# EasyEDA Pro project ArmRobot.eprj

# Schematic ArmRobot
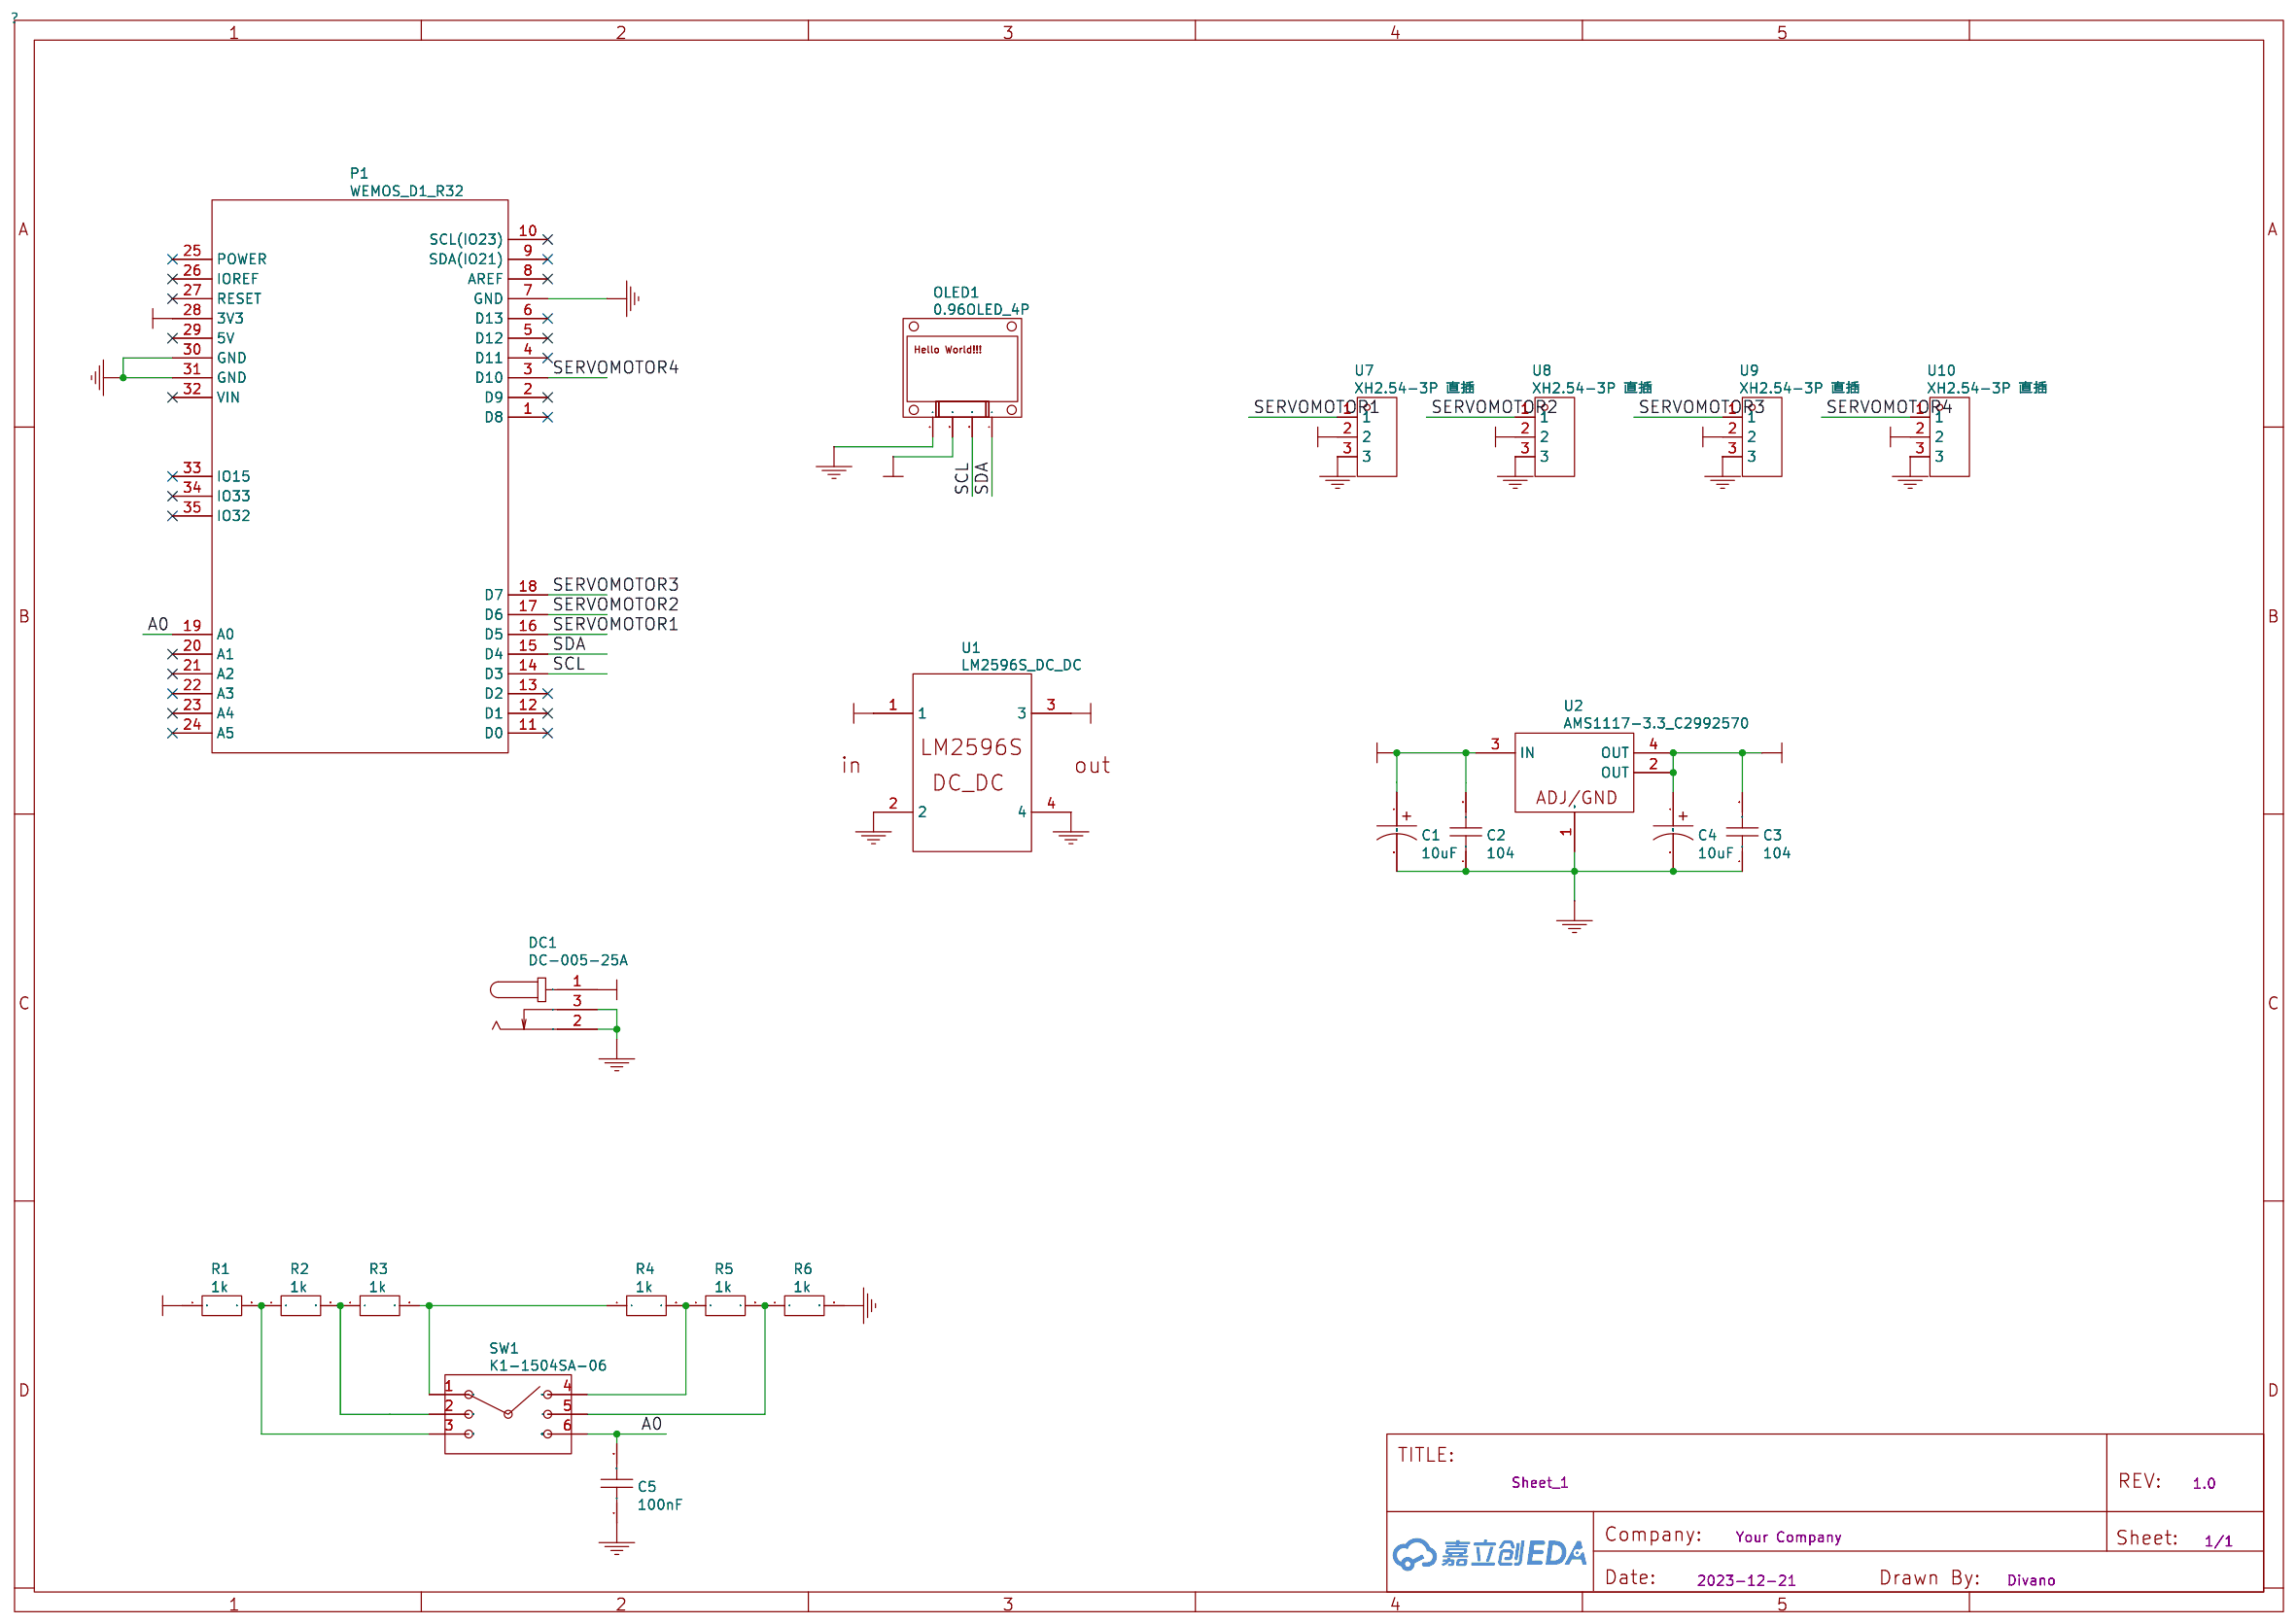
[diagram p0: schematic sheet]

## Parts
C1  10uF  [CASE-A_3216]
C2  104  [C0805]
C3  104  [C0805]
C4  10uF  [CASE-A_3216]
C5  100nF  [C0805]
DC1  DC-005-25A  [DC-IN-TH_DC005]
OLED1  0.96OLED_4P  [0.96OLED_4P]
P1  WEMOS_D1_R32  [WEMOS_D1_R32]
R1  1k  [R0805]
R2  1k  [R0805]
R3  1k  [R0805]
R4  1k  [R0805]
R5  1k  [R0805]
R6  1k  [R0805]
SW1  K1-1504SA-06  [SW-SMD_K1-1504SA-06]
U1  LM2596S_DC_DC  [LM2596S_DC_DC]
U2  AMS1117-3.3_C2992570  [SOT-223-3_L6.4-W3.5-P2.30-LS7.0-BR]
U7  XH2.54-3P 直插  [CONN-TH_XH2.54-3P]
U8  XH2.54-3P 直插  [CONN-TH_XH2.54-3P]
U9  XH2.54-3P 直插  [CONN-TH_XH2.54-3P]
U10  XH2.54-3P 直插  [CONN-TH_XH2.54-3P]

## Library data of the parts
C1 C4 = 10uF
C2 C3 = 104
C5 = 100nF
DC1 = DC-005-25A: Supplier: LCSC; Manufacturer: HRO; Supplier Part: C136715; JLCPCB Part Class: Extended Part; link: https://so.szlcsc.com/global.html?k=C136715&amp;ref=editor
OLED1 = 0.96OLED_4P: Supplier: LCSC
P1 = WEMOS_D1_R32: Manufacturer Part: NA; Supplier Part: TAOBAO; Manufacturer: NA; link: NA
R1-R6 = 1k
SW1 = K1-1504SA-06: Supplier: LCSC; Manufacturer: 韩国韩荣; Supplier Part: C136712; JLCPCB Part Class: Extended Part; link: https://so.szlcsc.com/global.html?k=C136712&amp;ref=editor
U1 = LM2596S_DC_DC
U2 = AMS1117-3.3_C2992570: Supplier: LCSC; Supplier Part: C2992570; Manufacturer: 国芯佳品; Manufacturer Part: AMS1117-3.3; JLCPCB Part Class: Extended Part; link: https://so.szlcsc.com/global.html?k=C2992570&amp;ref=editor
U7-U10 = XH2.54-3P 直插: Supplier: LCSC; Supplier Part: C9900000727; Manufacturer: null; JLCPCB Part Class: Extended Part; link: https://so.szlcsc.com/global.html?k=C9900000727&amp;ref=editor

## Nets
+3.3V: C3.2 C4.1 OLED1.2 P1.28(3V3) R1.1 U2.2(OUT) U2.4(OUT)
+5V: C1.1 C2.2 U1.3 U2.3(IN) U7.2 U8.2 U9.2 U10.2
+12V: DC1.1 U1.1
GND: C1.2 C2.1 C3.1 C4.2 C5.1 DC1.2 DC1.3 OLED1.1 P1.7(GND) P1.30(GND) P1.31(GND) R6.2 U1.2 U1.4 U2.1(ADJ/GND) U7.3 U8.3 U9.3 U10.3
A0: C5.2 P1.19(A0) SW1.6(COMMON)
SCL: OLED1.3 P1.14(D3)
SDA: OLED1.4 P1.15(D4)
SERVOMOTOR1: P1.16(D5) U7.1
SERVOMOTOR2: P1.17(D6) U8.1
SERVOMOTOR3: P1.18(D7) U9.1
SERVOMOTOR4: P1.3(D10) U10.1
SW1_1: R3.2 R4.1 SW1.1(A)
SW1_2: R2.2 R3.1 SW1.2(B)
SW1_3: R1.2 R2.1 SW1.3(C)
SW1_4: R4.2 R5.1 SW1.4(CENTER)
SW1_5: R5.2 R6.1 SW1.5(D)

Not connected (* = marked no-connect by the designer): P1 1(D8)* 2(D9)* 4(D11)* 5(D12)* 6(D13)* 8(AREF)* 9(SDA(IO21))* 10(SCL(IO23))* 11(D0)* 12(D1)* 13(D2)* 20(A1)* 21(A2)* 22(A3)* 23(A4)* 24(A5)* 25(POWER)* 26(IOREF)* 27(RESET)* 29(5V)* 32(VIN)* 33(IO15)* 34(IO33)* 35(IO32)*

# Board PCB_ArmRobot
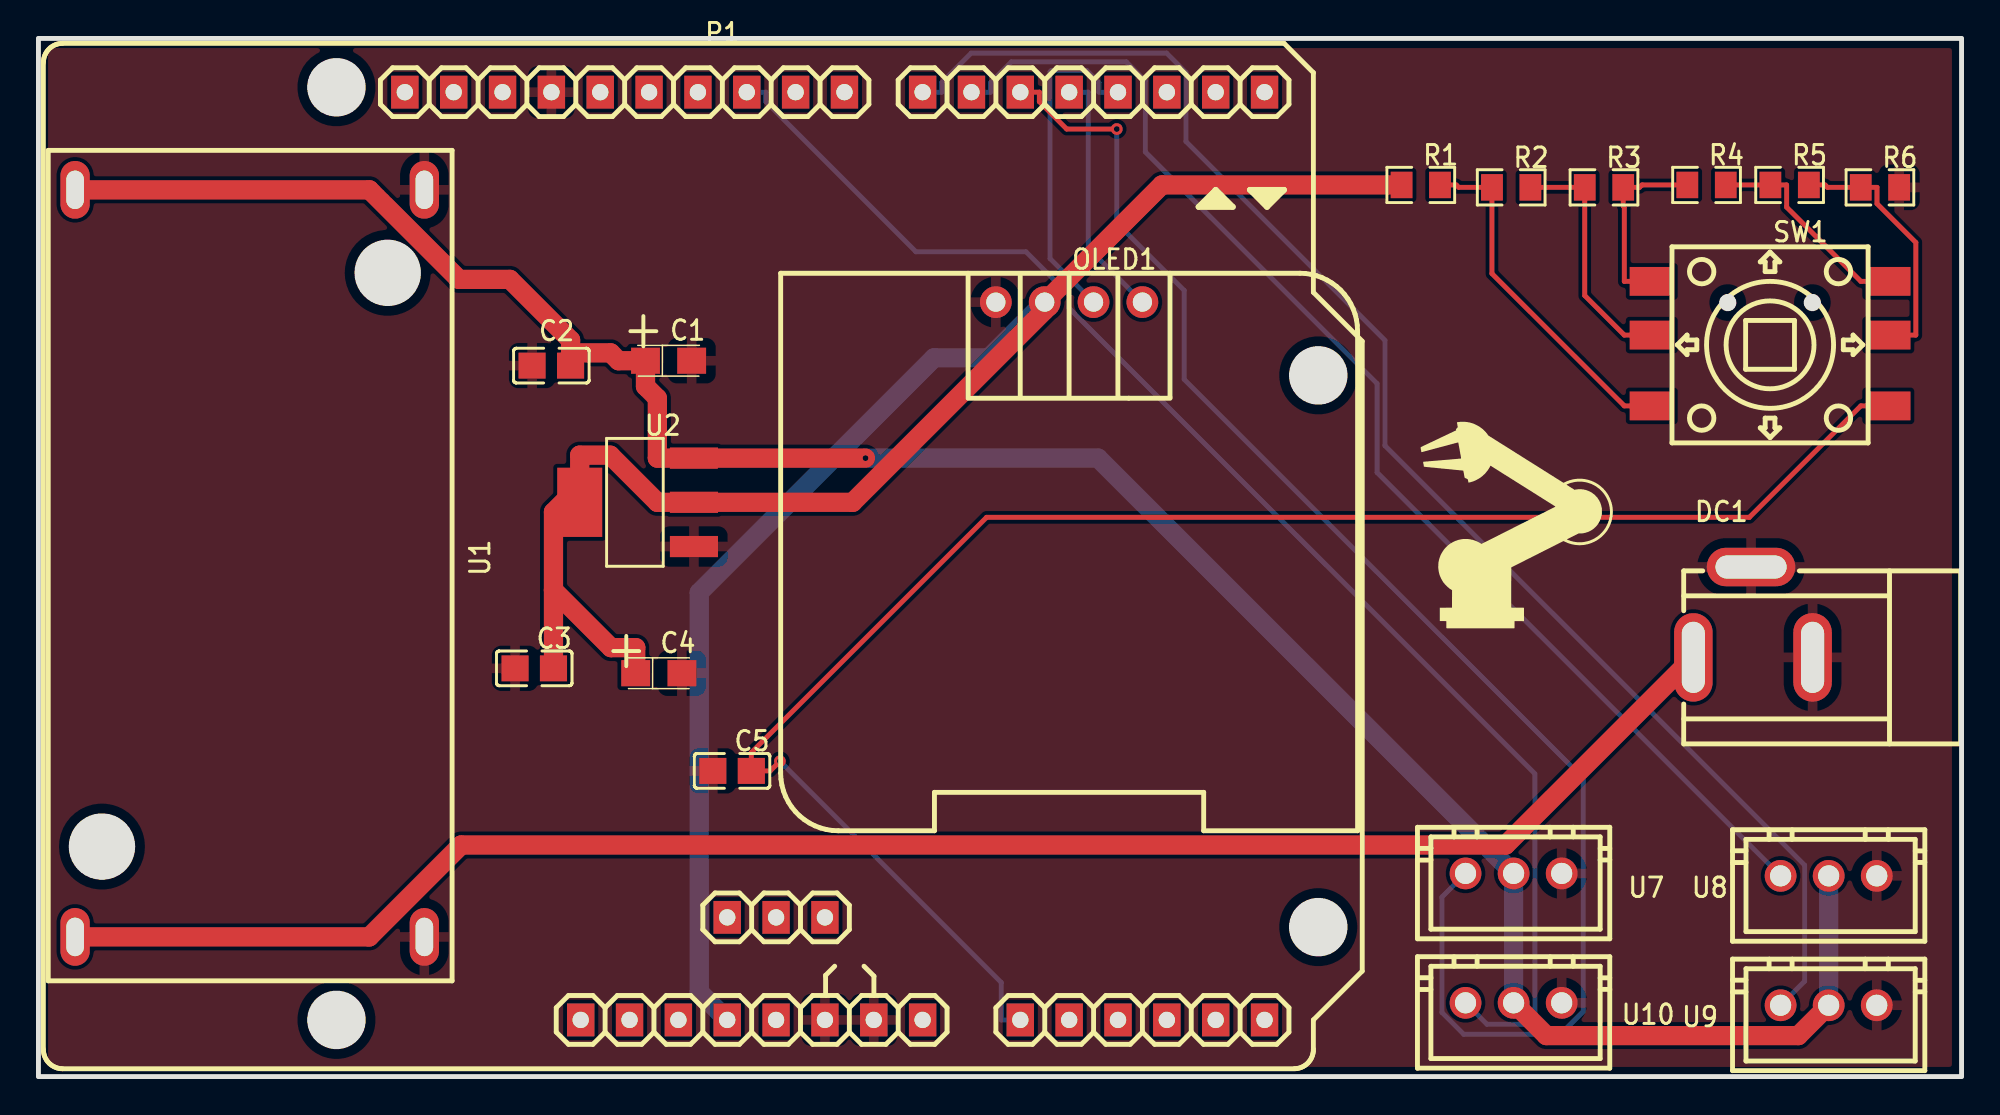
[diagram p1: board, top side]
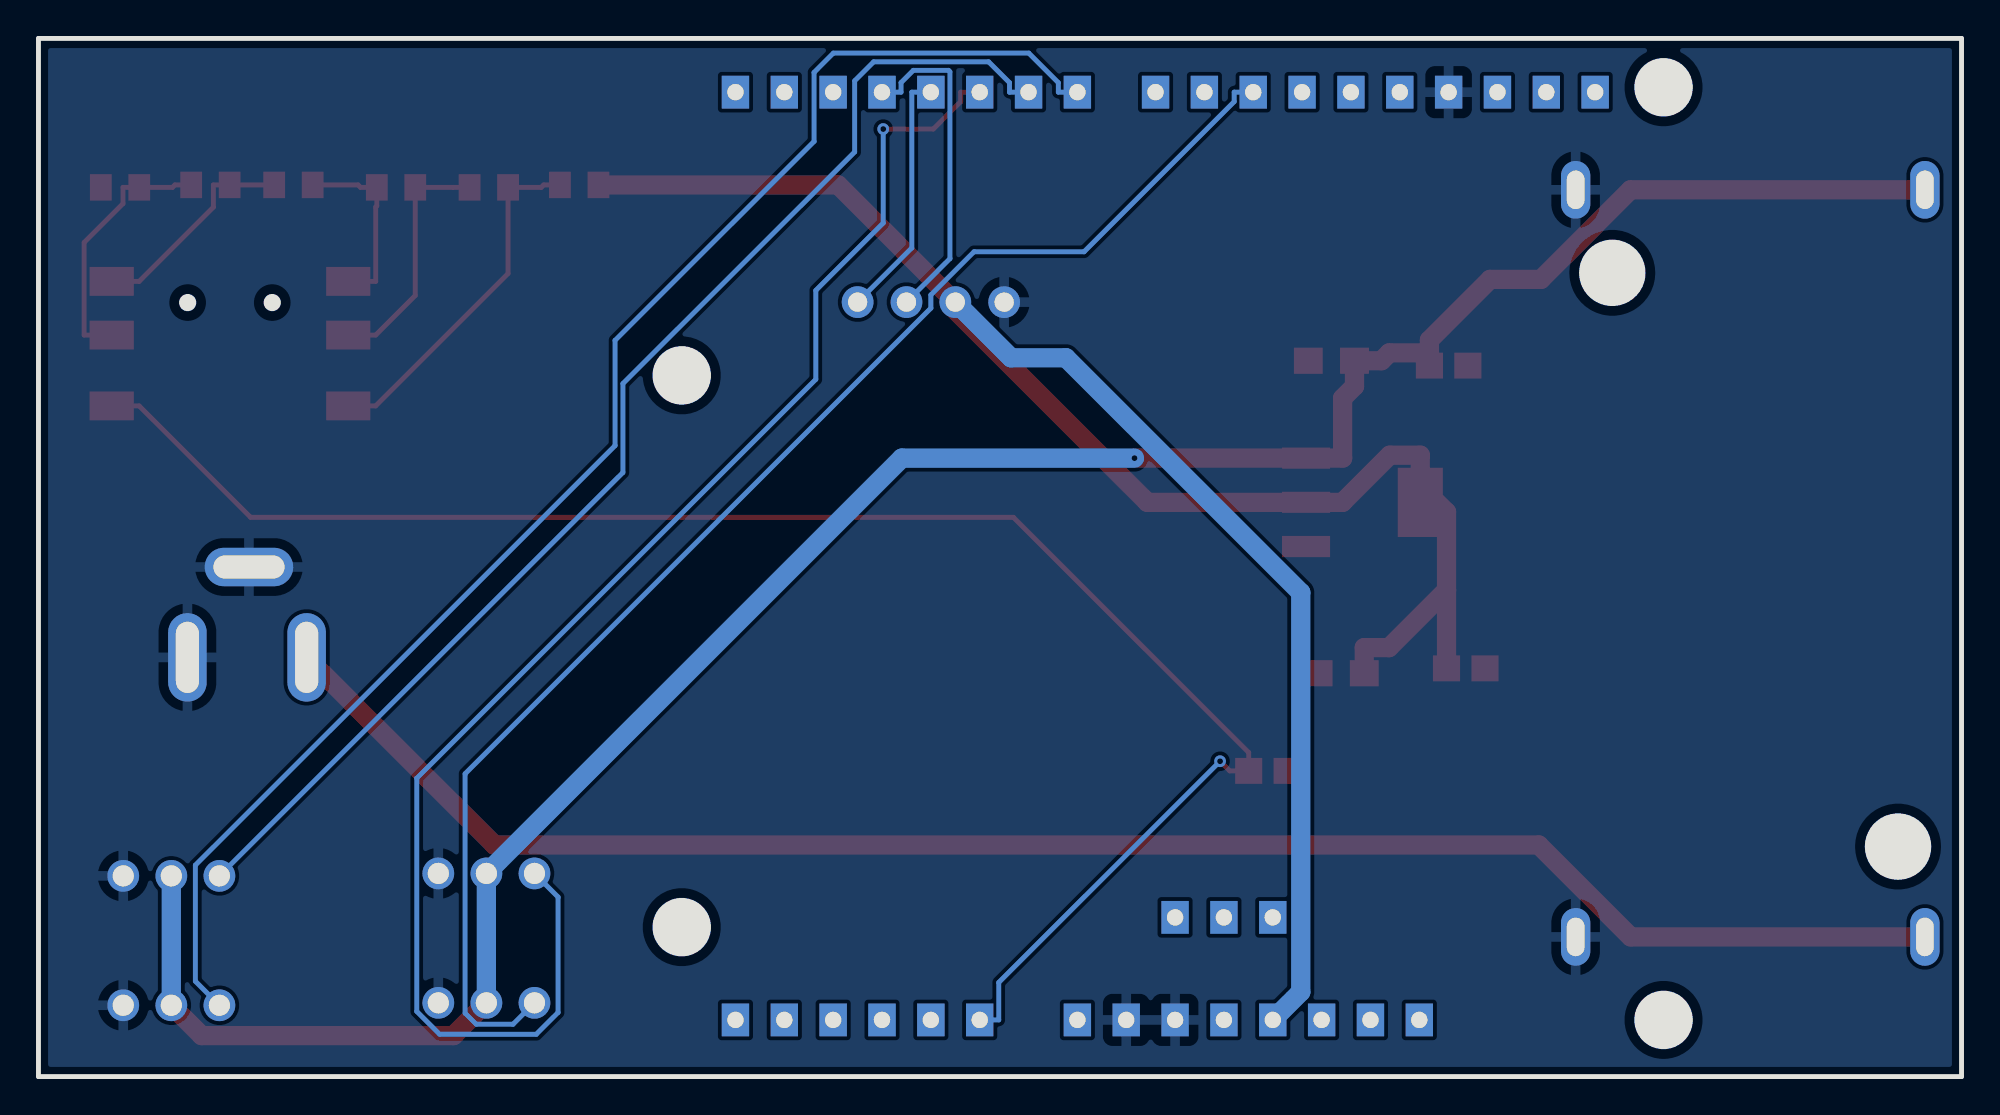
[diagram p2: board, bottom side, seen from below]

Outline 100 x 54 mm; copper layers: Top Layer, Bottom Layer. Coordinates in mm from the lower left corner of the outline.
Outline path: 0,54 100,54 100,0 0,0 0,54
Stack: Top Layer 0.035mm / Dielectric1 1.51mm FR4 er 4.5 / Bottom Layer 0.035mm

## Design rules (mm)
spacing Default (default): track to track 0.152, other pairs 0 to 0.152
spacing Power: track to track 0.152, other pairs 0 to 0.152
track width Default (default): min 0.254, default 0.254, max 25.4
track width Power: min 1, default 1, max 25.4
differential pair differentialPair (default): width min 0.127, default 0.254, max 2.54; gap min 0.152, default 0.152
via Default (default): diameter min 0.61, default 0.61, max 100.025; hole min 0.305, default 0.305, max 59.995
via Power: diameter min 0.61, default 0.61, max 100.025; hole min 0.305, default 0.305, max 59.995
net +3.3V uses Power
net +5V uses Power
net +12V uses Power
net GND uses gge8155
pour e64 uses gge8161
pour e150 uses gge8155

## Placement (name value [footprint] x y rotation side)
C1  10uF  [CASE-A_3216]  32.77 37.24 0 top
C2  104  [C0805]  26.67 36.98 0 top
C3  104  [C0805]  25.78 21.23 0 top
C4  10uF  [CASE-A_3216]  32.26 20.98 0 top
C5  100nF  [C0805]  36.07 15.9 0 top
DC1  DC-005-25A  [DC-IN-TH_DC005]  89.15 24.16 180 top
OLED1  -  [0.96OLED_4P]  53.59 40.28 0 top
P1  -  [WEMOS_D1_R32]  34.54 27.08 0 top
R1  1k  [R0805]  71.88 46.38 0 top
R2  1k  [R0805]  76.58 46.25 0 top
R3  1k  [R0805]  81.41 46.25 0 top
R4  1k  [R0805]  86.74 46.38 0 top
R5  1k  [R0805]  91.06 46.38 0 top
R6  1k  [R0805]  95.76 46.25 0 top
SW1  K1-1504SA-06  [SW-SMD_K1-1504SA-06]  90.04 38.12 0 top
U1  -  [LM2596S_DC_DC]  0.51 4.98 90 top
U2  AMS1117-3.3_C2992570  [SOT-223-3_L6.4-W3.5-P2.30-LS7.0-BR]  31.12 29.87 0 top
U7  XH2.54-3P 直插  [CONN-TH_XH2.54-3P]  76.71 10.57 0 top
U8  XH2.54-3P 直插  [CONN-TH_XH2.54-3P]  93.09 10.44 0 top
U9  XH2.54-3P 直插  [CONN-TH_XH2.54-3P]  93.09 3.71 0 top
U10  XH2.54-3P 直插  [CONN-TH_XH2.54-3P]  76.71 3.84 0 top

## Footprints (pads in the part's own frame, mm; a bottom-side part is the same pattern mirrored in y, then rotated)
0.96OLED_4P
  round 1.65 hole 1: 1(-3.81,-0.002) 2(-1.27,0.002) 3(1.27,0.002) 4(3.81,0.002)
C0805
  rect 1.41x1.35 smd: 1(-1,0) 2(1,0)
CASE-A_3216
  rect 1.5x1.359 smd: 1(-1.2,0) 2(1.2,0)
CONN-TH_XH2.54-3P
  round 1.65 hole 1.1: 1(-2.5,0) 2(0,0) 3(2.5,0)
DC-IN-TH_DC005
  oval 2x4.6 hole 1.2x3.7: 1(3.1,2.35) 2(-3.1,2.35)
  oval 4.6x2 hole 3.7x1.2: 3(0.1,-2.35)
LM2596S_DC_DC
  oval 3x1.524 hole 2x0.914: 1(2.286,-1.397) 2(2.286,-19.558) 3(41.148,-1.397) 4(41.148,-19.558)
R0805
  rect 1.133x1.377 smd: 1(-1,0) 2(1,0)
SOT-223-3_L6.4-W3.5-P2.30-LS7.0-BR
  rect 2.5x1.1 smd: 1(2.97,-2.3) 2(2.97,0) 3(2.97,2.3)
  rect 2.34x3.6 smd: 4(-2.97,0)
SW-SMD_K1-1504SA-06
  rect 2.3x1.5 smd: 1(-6.15,3.239) 2(-6.15,0.445) 3(-6.15,-3.239) 4(6.15,3.239) 5(6.15,0.445) 6(6.15,-3.239)
WEMOS_D1_R32
  rect 1.423x1.707 hole 0.849: 1(7.368,24.13) 2(4.828,24.13) 3(2.288,24.13) 4(-0.252,24.13) 5(-2.792,24.13) 6(-5.332,24.13) 7(-7.872,24.13) 8(-10.412,24.13) 9(-12.952,24.13) 10(-15.492,24.13) 11(29.212,24.13) 12(26.672,24.13) 13(24.132,24.13) 14(21.592,24.13) 15(19.052,24.13) 16(16.512,24.13) 17(13.972,24.13) 18(11.432,24.13) 19(16.512,-24.13) 20(19.052,-24.13) 21(21.592,-24.13) 22(24.132,-24.13) 23(26.672,-24.13) 24(29.212,-24.13) 25(-6.348,-24.13) 26(-3.808,-24.13) 27(-1.268,-24.13) 28(1.272,-24.13) 29(3.812,-24.13) 30(6.352,-24.13) 31(8.892,-24.13) 32(11.432,-24.13) 33(1.272,-18.796) 34(3.812,-18.796) 35(6.352,-18.796)

## Nets
As in the schematic.

Pads without a net: P1 1 2 4 5 6 8 9 10 11 12 13 20 21 22 23 24 25 26 27 29 32 33 34 35

## Via types
v1: diameter 0.61, hole 0.305, Top Layer to Bottom Layer, 3 vias

## Routing (per net, layer and track width the routed paths; a pad name or vN(x,y) marks a point on that pad's centre or on a via; arc(x,y) is an arc through that point)
+3.3V: length 117.3
  Top Layer w1: 26.78,25.3 C3.2 ; 26.78,25.3 29.77,22.31 31.06,22.31 C4.1 ; 26.78,25.3 26.78,29.37 28.15,30.73 ; R1.1 58.42,46.38 OLED1.2 52.32,39.86 42.34,29.87 U2.2 32.18,29.87 29.73,32.32 28.15,32.32 28.15,30.73 ; 28.15,30.73 U2.4
  Bottom Layer w1: P1.28 34.36,4.4 34.36,25.18 46.57,37.39 49.43,37.39 OLED1.2
+5V: length 124.4
  Top Layer w1: U1.3 17.21,46.13 21.87,41.47 24.51,41.47 27.67,38.31 27.67,37.65 ; U9.2 91.51,2.13 78.41,2.13 U10.2 ; 27.67,37.65 C2.2 ; 27.67,37.65 29.75,37.65 30.16,37.24 C1.1 31.57,35.9 32.18,35.29 32.18,32.17 U2.3 v1(43.01,32.17)
  Bottom Layer w1: U9.2 U8.2 ; U10.2 U7.2 55.1,32.17 v1(43.01,32.17)
+12V: length 90.2
  Top Layer w1: DC1.1 76.29,12.05 21.98,12.05 17.2,7.26 U1.1
A0: length 88.5
  Top Layer w0.254: v1(38.56,16.4) 38.05,15.9 C5.2 37.07,16.85 49.3,29.09 88.97,29.09 94.76,34.89 SW1.6
  Bottom Layer w0.254: v1(38.56,16.4) 50.07,4.89 50.07,2.95 P1.19
SCL: length 17.2
  Bottom Layer w0.254: OLED1.3 52.6,42.55 52.6,52.27 52.68,52.34 54.51,52.34 55.15,51.7 55.15,51.21 P1.14
SDA: length 13.1
  Bottom Layer w0.254: P1.15 54.59,51.21 54.59,43.1 OLED1.4
SERVOMOTOR1: length 78.1
  Top Layer w0.254: P1.16 52.05,51.21 52.05,50.71 53.47,49.29 v1(56.07,49.29)
  Bottom Layer w0.254: v1(56.07,49.29) 56.07,44.4 59.58,40.89 59.58,36.27 80.33,15.52 80.33,3.39 79.14,2.2 74.11,2.2 72.98,3.33 72.98,9.34 U7.1
SERVOMOTOR2: length 65.4
  Bottom Layer w0.254: U8.1 69.61,31.42 69.61,36.04 57.56,48.09 57.56,51.79 56.57,52.78 50.59,52.78 49.51,51.7 49.51,51.21 P1.17
SERVOMOTOR3: length 77.6
  Bottom Layer w0.254: P1.18 46.97,51.21 46.97,51.7 48.5,53.24 58.66,53.24 59.67,52.23 59.67,48.64 70.02,38.29 70.02,32.82 91.84,10.99 91.84,4.96 U9.1
SERVOMOTOR4: length 73.1
  Bottom Layer w0.254: P1.3 37.82,51.21 37.82,50.71 45.63,42.9 51.35,42.9 53.59,40.66 53.59,39.97 77.81,15.75 77.81,3.3 77.23,2.72 75.32,2.72 U10.1
SW1_1: length 9.7
  Top Layer w0.254: R4.1 83.38,46.38 83.25,46.25 R3.2 82.41,45.29 82.46,45.23 82.46,41.36 SW1.1
SW1_2: length 12.8
  Top Layer w0.254: SW1.2 82.46,38.57 80.41,40.63 R3.1 R2.2
SW1_3: length 18.4
  Top Layer w0.254: R1.2 73.73,46.38 73.85,46.25 R2.1 75.58,41.77 82.46,34.89 SW1.3
SW1_4: length 11.2
  Top Layer w0.254: SW1.4 94.76,41.36 90.9,45.22 90.9,46.38 R5.1 R4.2
SW1_5: length 13.5
  Top Layer w0.254: R5.2 92.9,46.38 93.03,46.25 R6.1 95.6,46.25 95.6,45.41 97.62,43.39 97.62,38.57 ; SW1.5 97.62,38.57

## Copper pours and planes (outline as drawn; the poured copper is in the pictures)
GND on Top Layer: -5.33,58.83 109.09,58.83 109.35,59.08 109.35,-4.42 108.97,-4.8 -11.56,-4.8 -13.21,-6.45
GND on Bottom Layer: -4.32,57.94 109.73,57.94 109.73,-0.61 104.01,-6.32 -5.08,-6.32 -8.38,-3.02

## Text on the board
Top Silkscreen Layer: +
